# EasyEDA Pro project 【群友_M._分享】明纬rps200-24v-电源PCB垫板-内含2个版本-捷配白嫖-新.epro

# Board RPS200-24_海凌科HLK-PM01等三合一5V模块
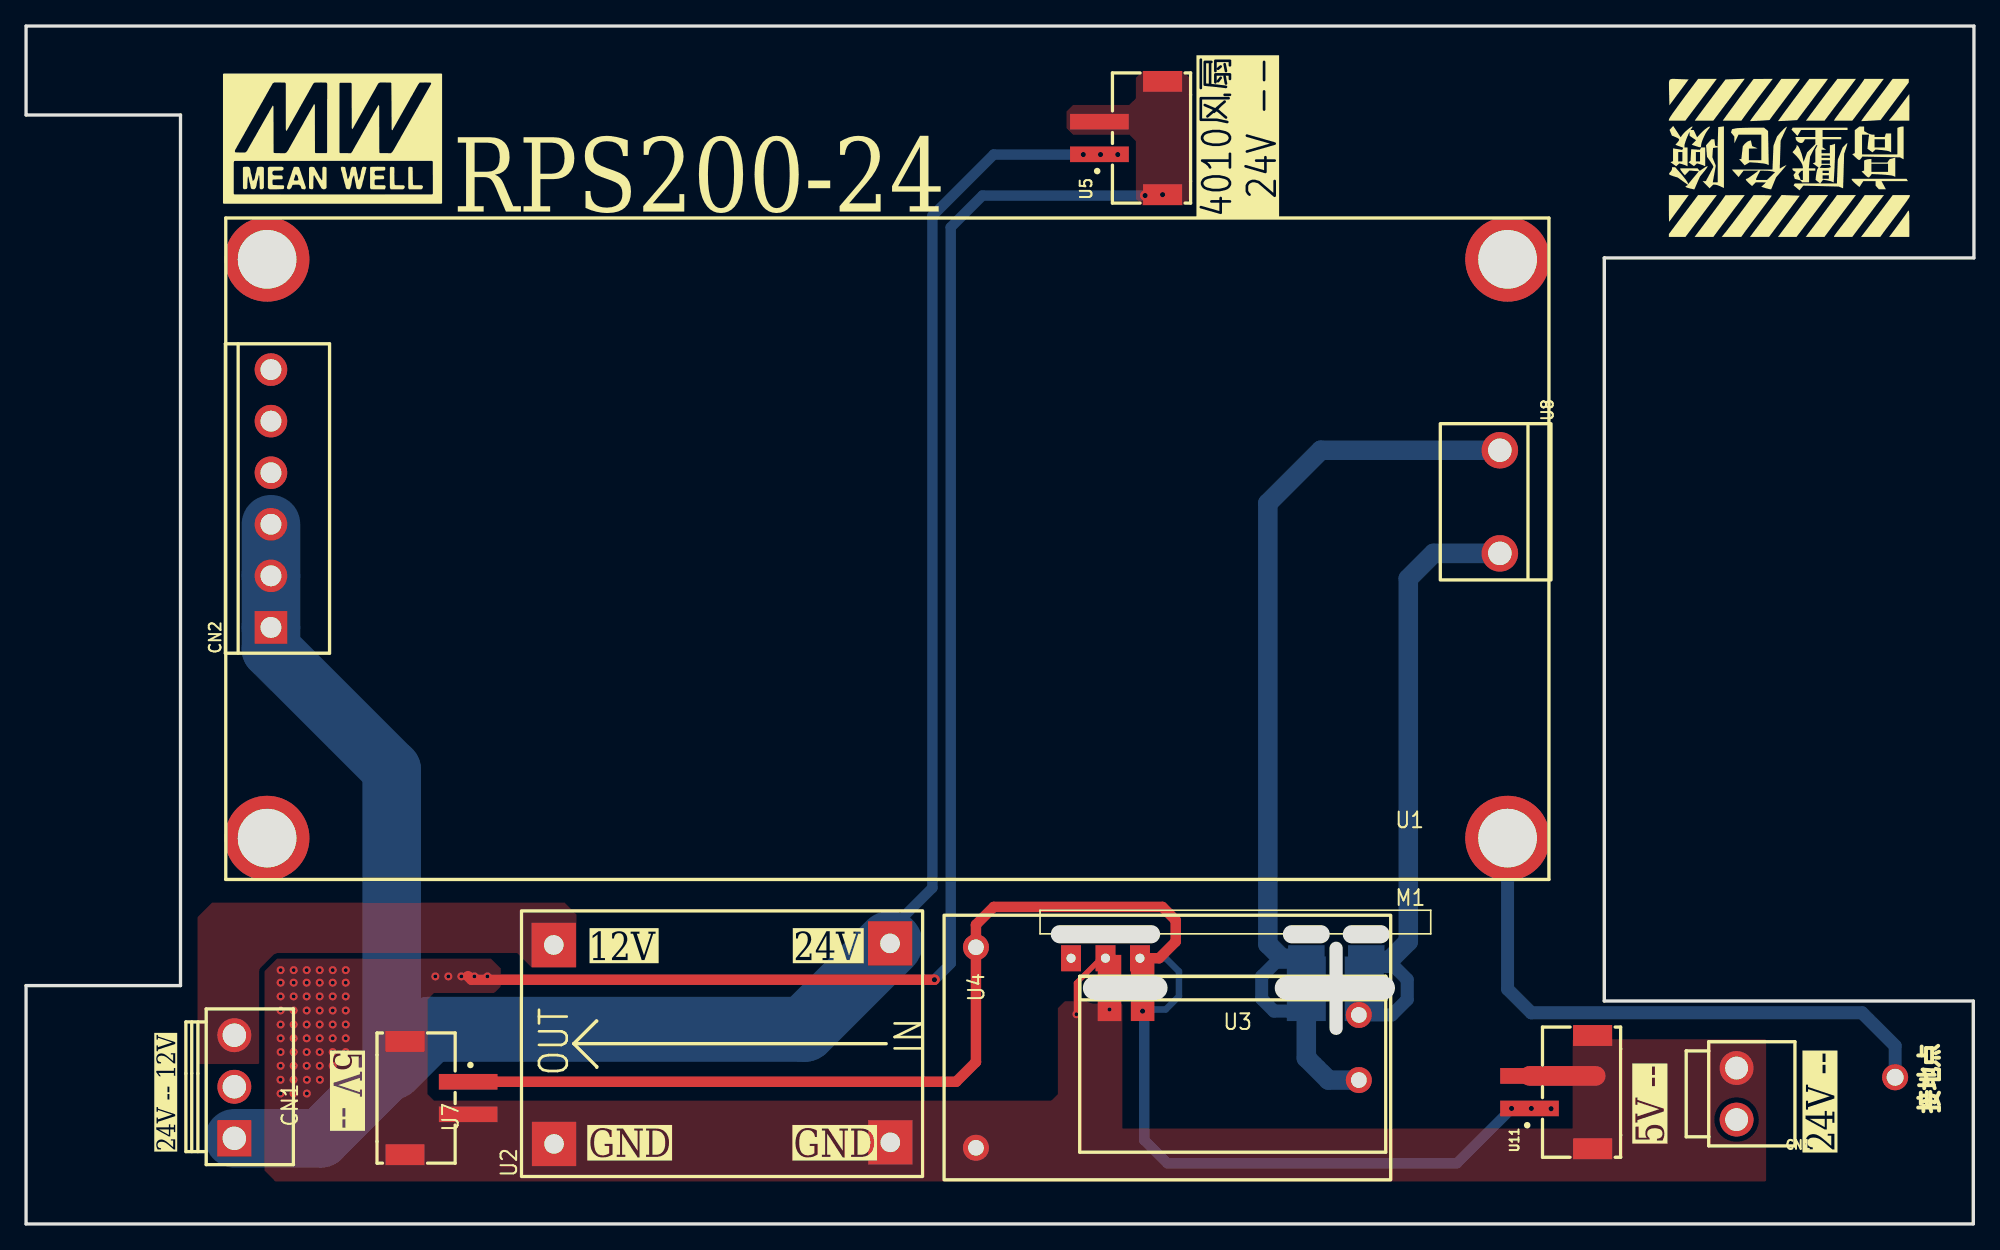
[diagram p0: board, top side]
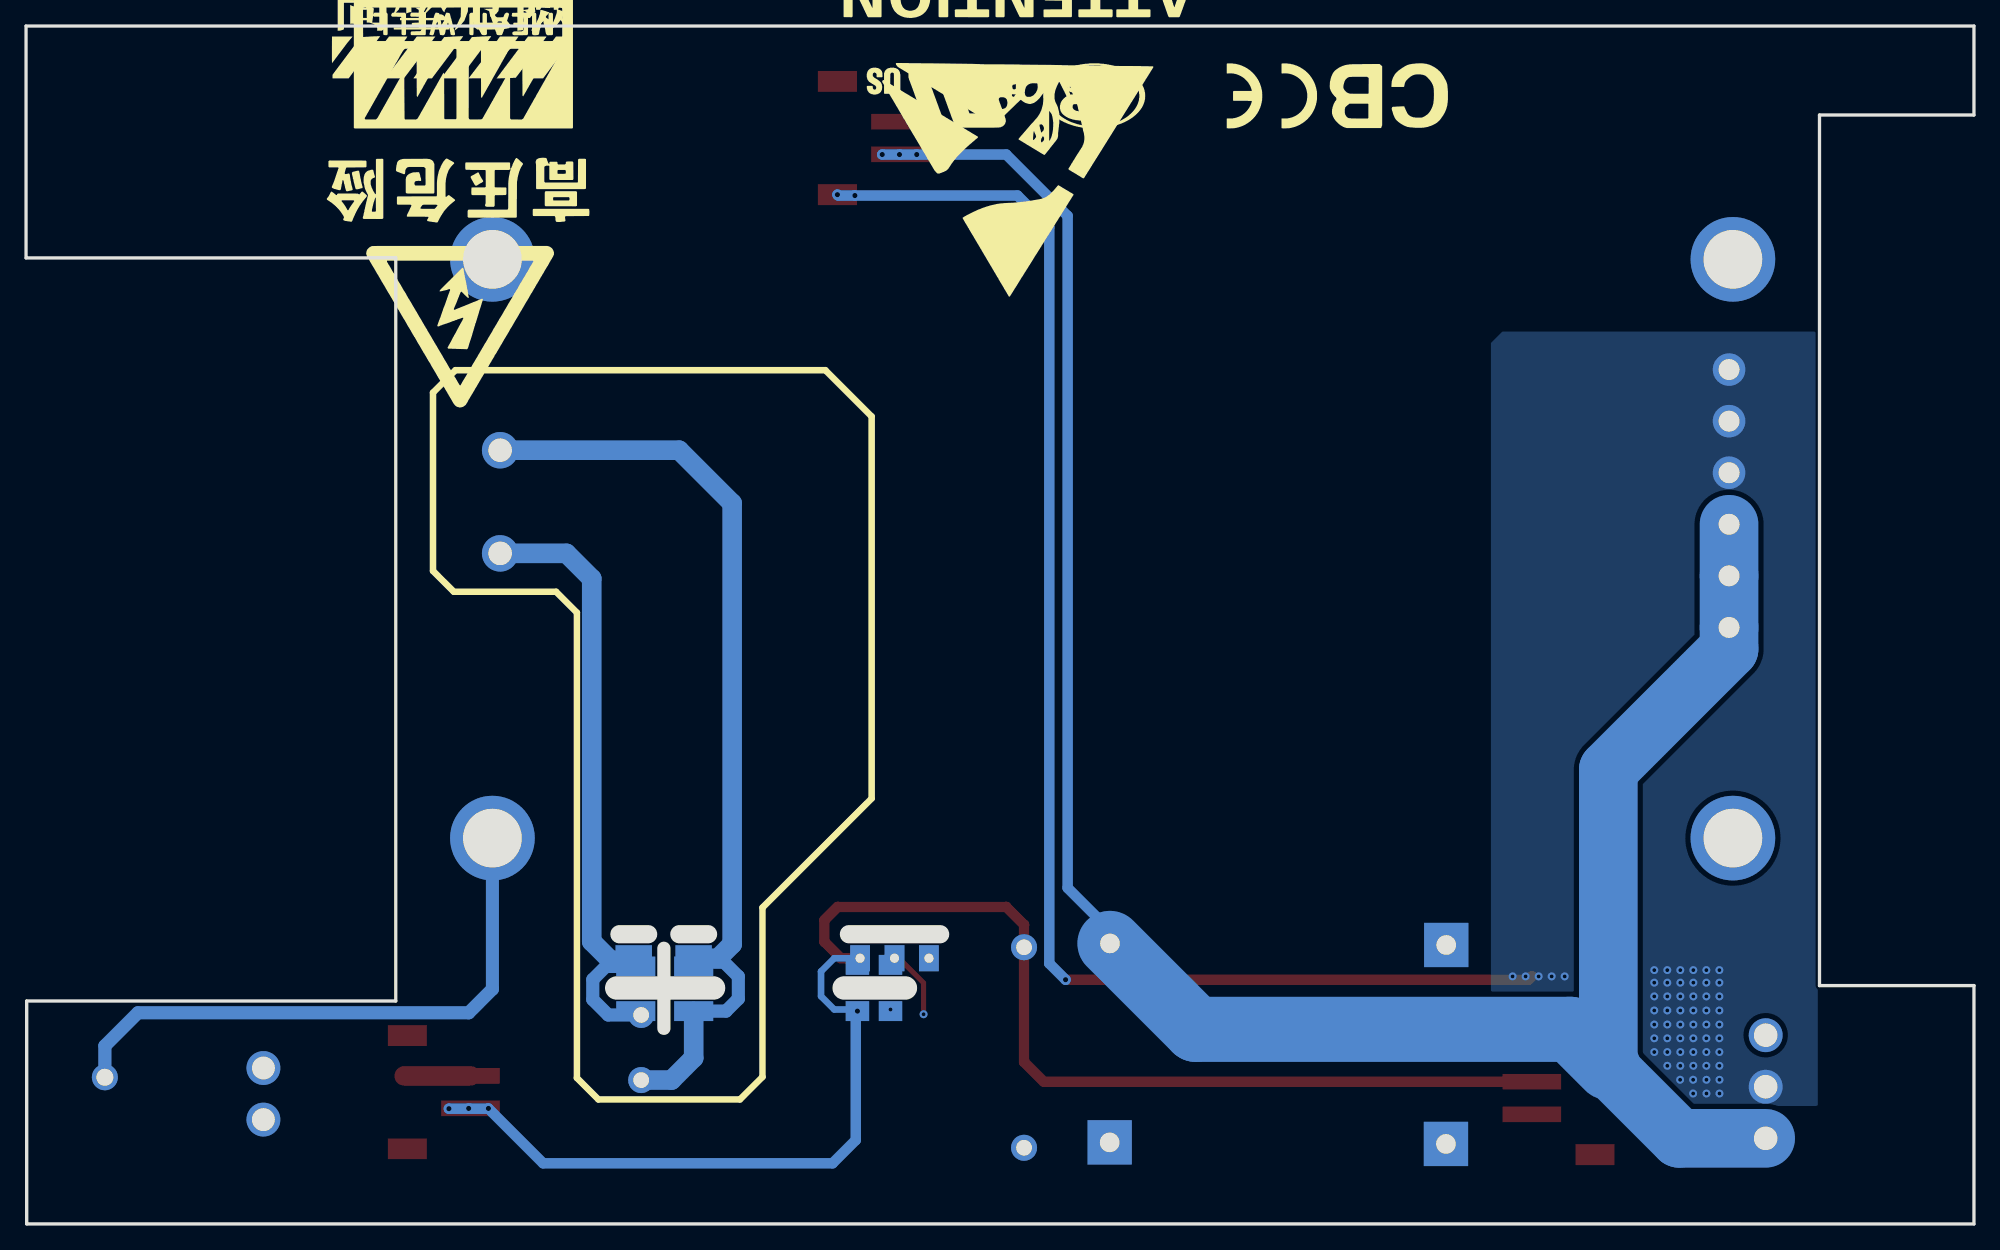
[diagram p1: board, bottom side, seen from below]

Outline 149.57 x 92 mm; copper layers: Top Layer, Inner1, Inner2, Bottom Layer. Coordinates in mm from the lower left corner of the outline.
Outline path: 0,92 0,85.17 11.86,85.17 11.86,18.31 0,18.31 0,0 149.52,0 149.52,17.12 121.18,17.12 121.18,74.19 149.57,74.19 149.57,92 0,92
Stack: Top Layer 0.035mm 外层铜厚1oz / Dielectric1 0.2104mm 7628 RC49% 8.6mil / Inner1 0.0152mm 内层铜厚 / Dielectric2 1.065mm 1.1mm H/HOZ Copper / Inner2 0.0152mm 内层铜厚 / Dielectric3 0.2104mm 7628 RC49% 8.6mil / Bottom Layer 0.035mm 外层铜厚1oz

## Design rules (mm)
template: 自定义配置
spacing copperThickness1oz (default): track to track 0.102, other pairs 0 to 0.3
spacing copperThickness2oz: track to track 0.203, other pairs 0.152 to 0.3
track width copperThickness1oz (default): min 0.127, default 0.254, max 5
track width copperThickness2oz: min 0.203, default 0.254, max 2.54
differential pair differentialPair (default): width min 0.127, default 0.254, max 2.54; gap min 0.152, default 0.152
via viaSize (default): diameter min 0.5, default 0.61, max 10; hole min 0.3, default 0.305, max 6.3

## Placement (name value [footprint] x y rotation side)
CN1  -  [CONN-TH_3P-P3.96_FWF39601-S03S22W1B]  15.99 10.54 90 top
CN1#2  -  [CONN-TH_2P-P3.96_C9900035759]  131.34 10 90 top
CN2  ZX-VH3.96-6PZZ  [CONN-TH_6P-P3.96_ZX-VH3.96-6PZZ]  18.8 55.71 90 top
M1  AC-DC-5V-3.3V-700MA  [wo-220-5v-3.3v-700ma_update]  91.58 20.41 0 top
NOREF  -  [Pad_e18]  143.52 11.26 0 top
U1  -  [RPS-200]  57.92 56.86 180 top
U2  -  [SY8205]  68.84 3.64 90 top
U3  5V700mA电源模块  [5V700MA]  104.4 19.01 270 top
U4  HLK-PM01  [PWRM-TH_HLK-PM01]  87.64 13.55 180 top
U5  ZX-XH2.54-2PLT  [CONN-SMD_2P-P2.50_HCTL_HC-XH-2ALT]  84.84 83.4 90 top
U7  ZX-XH2.54-2PLT  [CONN-SMD_2P-P2.50_HCTL_HC-XH-2ALT]  31.52 9.67 270 top
U8  VH3.96-3P(2P) ZZ  [CONN-TH_VH3.96-3A2]  113.17 55.46 270 top
U11  ZX-XH2.54-2PLT  [CONN-SMD_2P-P2.50_HCTL_HC-XH-2ALT]  117.86 10.12 90 top

## Footprints (pads in the part's own frame, mm; a bottom-side part is the same pattern mirrored in y, then rotated)
5V700MA
  rect 1.524x3 smd far side: 1(2.667,-1.651) 2(2.667,-6.096) 5(-0.762,-1.651) 6(-0.762,-6.096)
  rect 1.524x1.8 smd far side: 3(2.667,-21.209) 4(2.667,-18.669) 7(-0.889,-18.669) 8(-0.889,-21.209)
  rect 1.524x1.8 smd: 9(-0.889,-18.669) 10(-0.889,-21.209) 11(2.667,-21.209) 12(2.667,-18.669)
CONN-SMD_2P-P2.50_HCTL_HC-XH-2ALT
  rect 1.2x4.5 smd: 1(-1.25,2.425) 2(1.25,2.425)
  rect 1.6x3 smd: 3(4.35,-2.425) 4(-4.35,-2.425)
CONN-TH_2P-P3.96_C9900035759
  round 2.6 hole 1.75: 1(-1.98,0) 2(1.98,0)
CONN-TH_3P-P3.96_FWF39601-S03S22W1B
  rect 2.8x2.6 hole 1.8: 1(-3.96,0)
  round 2.6 hole 1.8: 2(0,0) 3(3.96,0)
CONN-TH_6P-P3.96_ZX-VH3.96-6PZZ
  rect 2.5x2.5 hole 1.6: 1(-9.9,0)
  round 2.5 hole 1.6: 2(-5.94,0) 3(-1.98,0) 4(1.98,0) 5(5.94,0) 6(9.9,0)
CONN-TH_VH3.96-3A2
  round 2.8 hole 1.8: 1(-3.96,0) 2(3.96,0)
Pad_e18
  round 2 hole 1.3: 1(0,0)
PWRM-TH_HLK-PM01
  round 2 hole 1.2: 1(-14.7,2.5) 2(-14.7,-2.5) 3(14.7,7.7) 4(14.7,-7.7)
RPS-200
  round 6.5 hole 4.5: 1(-55.839,27.225) 2(39.411,27.225) 3(39.411,-17.225) 4(-55.839,-17.225)
SY8205
  rect 3.4x3.4 hole 1.5: 1(2.5,28.3) 2(2.62,2.479) 3(17.9,2.5) 4(17.78,28.321)
wo-220-5v-3.3v-700ma_update
  rect 2.8x2 smd far side: 1(11.334,0) 2(6.734,0)
  rect 1.524x2 hole 0.7: 3(-6.046,0) 4(-8.69,0) 5(-11.334,0)

## Nets
5V: M1.3 U3.4 U3.7 U3.9 U3.12 U4.4 U7.1 U11.1
12V: CN1.3 U2.4
24V: CN1.1 CN1#2.1 CN2.1 CN2.2 CN2.3 U2.3 U5.1
GND: CN1.2 CN1#2.2 CN2.4 CN2.5 CN2.6 M1.4 U2.1 U2.2 U3.3 U3.8 U3.10 U3.11 U4.3 U5.2 U5.3 U5.4 U7.2 U7.3 U7.4 U11.2 U11.3 U11.4
E: NOREF.1 U1.1
L: M1.2 U3.2 U3.6 U4.1 U8.1
N: M1.1 U3.1 U3.5 U4.2 U8.2

Pads without a net: M1 5; U1 2 3 4

## Via types
v1: diameter 0.8, hole 0.4, Top Layer to Bottom Layer, 10 vias
v2: diameter 0.61, hole 0.305, Top Layer to Bottom Layer, 61 vias

## Routing (per net, layer and track width the routed paths; a pad name or vN(x,y) marks a point on that pad's centre or on a via; arc(x,y) is an arc through that point)
5V: length 123.8
  Top Layer w0.8: M1.3 87,20.41 88.27,21.68 88.27,23.33 87.26,24.35 74.3,24.35 72.94,22.98 U4.4 72.94,12.44 71.42,10.92 U7.1
  Bottom Layer w0.5: 85.53,21.04 86.16,20.41 87.51,20.41 88.53,19.39 88.53,17.49 87.51,16.47 85.86,16.47
  Bottom Layer w0.8: 85.86,16.47 85.86,6.44 87.64,4.66 109.86,4.66 114.05,8.85 v1(117.1,8.85)
  vias: v1(85.73,16.34) v1(114.07,8.87) v1(115.58,8.87)
24V: length 174.4
  Bottom Layer w0.8: 82.4,82.13 v1(81.18,82.13) 74.3,82.13 69.59,77.42 69.59,25.81 66.34,22.56 ; v1(82.5,82.13) v1(83.83,82.13)
  Bottom Layer w4.5: CN2.3 CN2.2 CN2.1 18.8,44.16 28.08,34.89 28.08,12.03 22.62,6.58 CN1.1
  Bottom Layer w5: U2.3 59.75,14.95 31,14.95 28.08,12.03
GND: length 122.1
  Top Layer w0.4: v2(80.65,16.11) 80.65,18.5 82.56,20.41 M1.4
  Top Layer w0.8: v1(69.75,18.76) 34.2,18.76 33.93,19.03
  Top Layer w1.5: U11.2 120.53,11.37
  Bottom Layer w0.8: v1(69.75,18.76) 71,20.01 71,76.54 73.44,78.98 v1(85.93,78.98) 87.2,78.98 v1(87.27,79.05)
  vias: v2(19.55,19.49) v2(19.55,18.53) v2(19.55,17.48) v2(19.55,16.4) v2(19.55,15.32) v2(19.55,14.26) v2(19.55,13.2) v2(19.55,12.15) v2(19.54,11.07) v2(19.54,10.02) v2(20.55,19.49) v2(20.55,18.53) v2(20.55,17.48) v2(20.55,16.4) v2(20.55,15.32) v2(20.55,14.26) v2(20.55,13.2) v2(20.55,12.15) v2(20.54,11.07) v2(20.54,10.02) v2(21.55,19.49) v2(21.55,18.53) v2(21.55,17.48) v2(21.55,16.4) v2(21.55,15.32) v2(21.55,14.26) v2(21.55,13.2) v2(21.55,12.15) v2(21.56,11.07) v2(21.56,10.02) v2(22.55,19.49) v2(22.55,18.53) v2(22.55,17.48) v2(22.55,16.4) v2(22.55,15.32) v2(22.55,14.26) v2(22.55,13.2) v2(22.55,12.15) v2(22.56,11.07) v2(23.55,19.49) v2(23.55,18.53) v2(23.55,17.48) v2(23.55,16.4) v2(23.55,15.32) v2(23.55,14.26) v2(23.55,13.2) v2(23.55,12.15) v2(24.55,19.49) v2(24.55,18.53) v2(24.55,17.48) v2(24.55,16.4) v2(24.55,15.32) v2(24.55,14.26) v2(24.55,13.2) v2(31.43,19.01) v2(32.43,19.01) v2(33.43,19.01) v2(34.43,19.01) v2(35.43,19.01) v2(83.19,16.47)
E: length 45.6
  Bottom Layer w1: NOREF.1 143.52,13.68 140.98,16.22 115.58,16.22 113.76,18.04 U1.1
L: length 74.6
  Bottom Layer w1: 98,20.09 U3.6 ; 97.98,20.1 95.97,20.1 94.88,19.01 94.88,17.29 95.82,16.34 U3.2
  Bottom Layer w1.5: U4.1 100.01,11.05 98.31,12.75 98.31,16.32 ; U8.1 99.42,59.42 95.35,55.35 95.35,21.48 96.44,20.4 98.31,20.4
N: length 49.6
  Bottom Layer w1: U3.5 105.05,19.77 106.05,18.77 106.05,17.23 104.87,16.05 U4.2 ; 102.34,16.56 102.85,16.56
  Bottom Layer w1.5: M1.1 103.08,20.24 104.68,20.24 106.13,21.69 106.13,49.56 108.07,51.5 U8.2

## Copper pours and planes (outline as drawn; the poured copper is in the pictures)
12V on Top Layer: 42.27,19.66 38.85,19.66 37.7,20.82 19.26,20.82 17.99,19.55 17.99,12.28 13.17,12.28 13.17,23.56 14.28,24.68 41.36,24.68 42.27,23.76
24V on Inner1: 80.45,2.59 79.75,2.89 71.69,10.95 70.98,11.24 69.26,11.24 68.55,11.53 64.51,15.57 64.22,16.28 64.22,23.76 64.68,24.22 68.3,24.22 68.79,23.73 68.79,18.64 69.08,17.93 71.6,15.42 72.3,15.13 77.42,15.13 78.13,14.83 84.35,8.61 85.06,8.32 92.41,8.32 93.11,8.03 93.9,7.24 94.61,6.95 125.87,6.95 129.17,10.25 135.01,10.25 135.64,9.61 135.64,3.07 135.17,2.59
24V on Inner2: 80.45,2.59 79.75,2.89 71.69,10.95 70.98,11.24 69.26,11.24 68.55,11.53 64.51,15.57 64.22,16.28 64.22,23.76 64.68,24.22 68.3,24.22 68.79,23.73 68.79,18.64 69.08,17.93 71.6,15.42 72.3,15.13 77.42,15.13 78.13,14.83 84.35,8.61 85.06,8.32 92.41,8.32 93.11,8.03 93.9,7.24 94.61,6.95 125.87,6.95 129.17,10.25 135.01,10.25 135.64,9.61 135.64,3.07 135.17,2.59
GND on Top Layer: 79.89,88.53 89.34,88.53 89.34,78.23 79.89,78.23
GND on Top Layer: 35.7,20.37 36.46,19.62 36.46,18.24 35.96,17.74 31.33,17.74 30.83,17.24 30.83,9.97 31.33,9.47 78.72,9.47 79.22,9.97 79.22,16.57 79.76,17.11 84.04,17.11 84.18,16.97 84.18,7.33 118.75,7.33 118.75,14.19 133.61,14.19 133.61,3.26 19.14,3.26 18.3,4.1 18.3,19.4 19.28,20.37
GND on Bottom Layer: 12,9.06 37.09,9.06 37.09,67.66 36.22,68.53 12,68.53
GND on Inner1: 36.46,19.62 36.46,18.24 35.96,17.74 31.33,17.74 30.83,17.24 30.83,9.97 31.33,9.47 72.36,9.47 74.18,7.66 74.18,3.26 19.14,3.26 18.3,4.1 18.3,19.35 19.31,20.36 35.72,20.36
GND on Inner2: 36.46,19.62 36.46,18.24 35.96,17.74 31.33,17.74 30.83,17.24 30.83,9.97 31.33,9.47 72.36,9.47 74.18,7.66 74.18,3.26 19.14,3.26 18.3,4.1 18.3,19.35 19.31,20.36 35.72,20.36

## Text on the board
Document Layer: 220V转5V模块 | 220V转5V、3V双输出模块 | 海凌科HLK-PM01 5V 3W
Top Silkscreen Layer: OUT | IN | RPS200-24 | 接地点 | 24V -- 12V | 12V | GND | 24V | 4010风扇 / 24V -- | 5V -- | 24V --

# Board RPS200-24_URB2405ZP-6WR
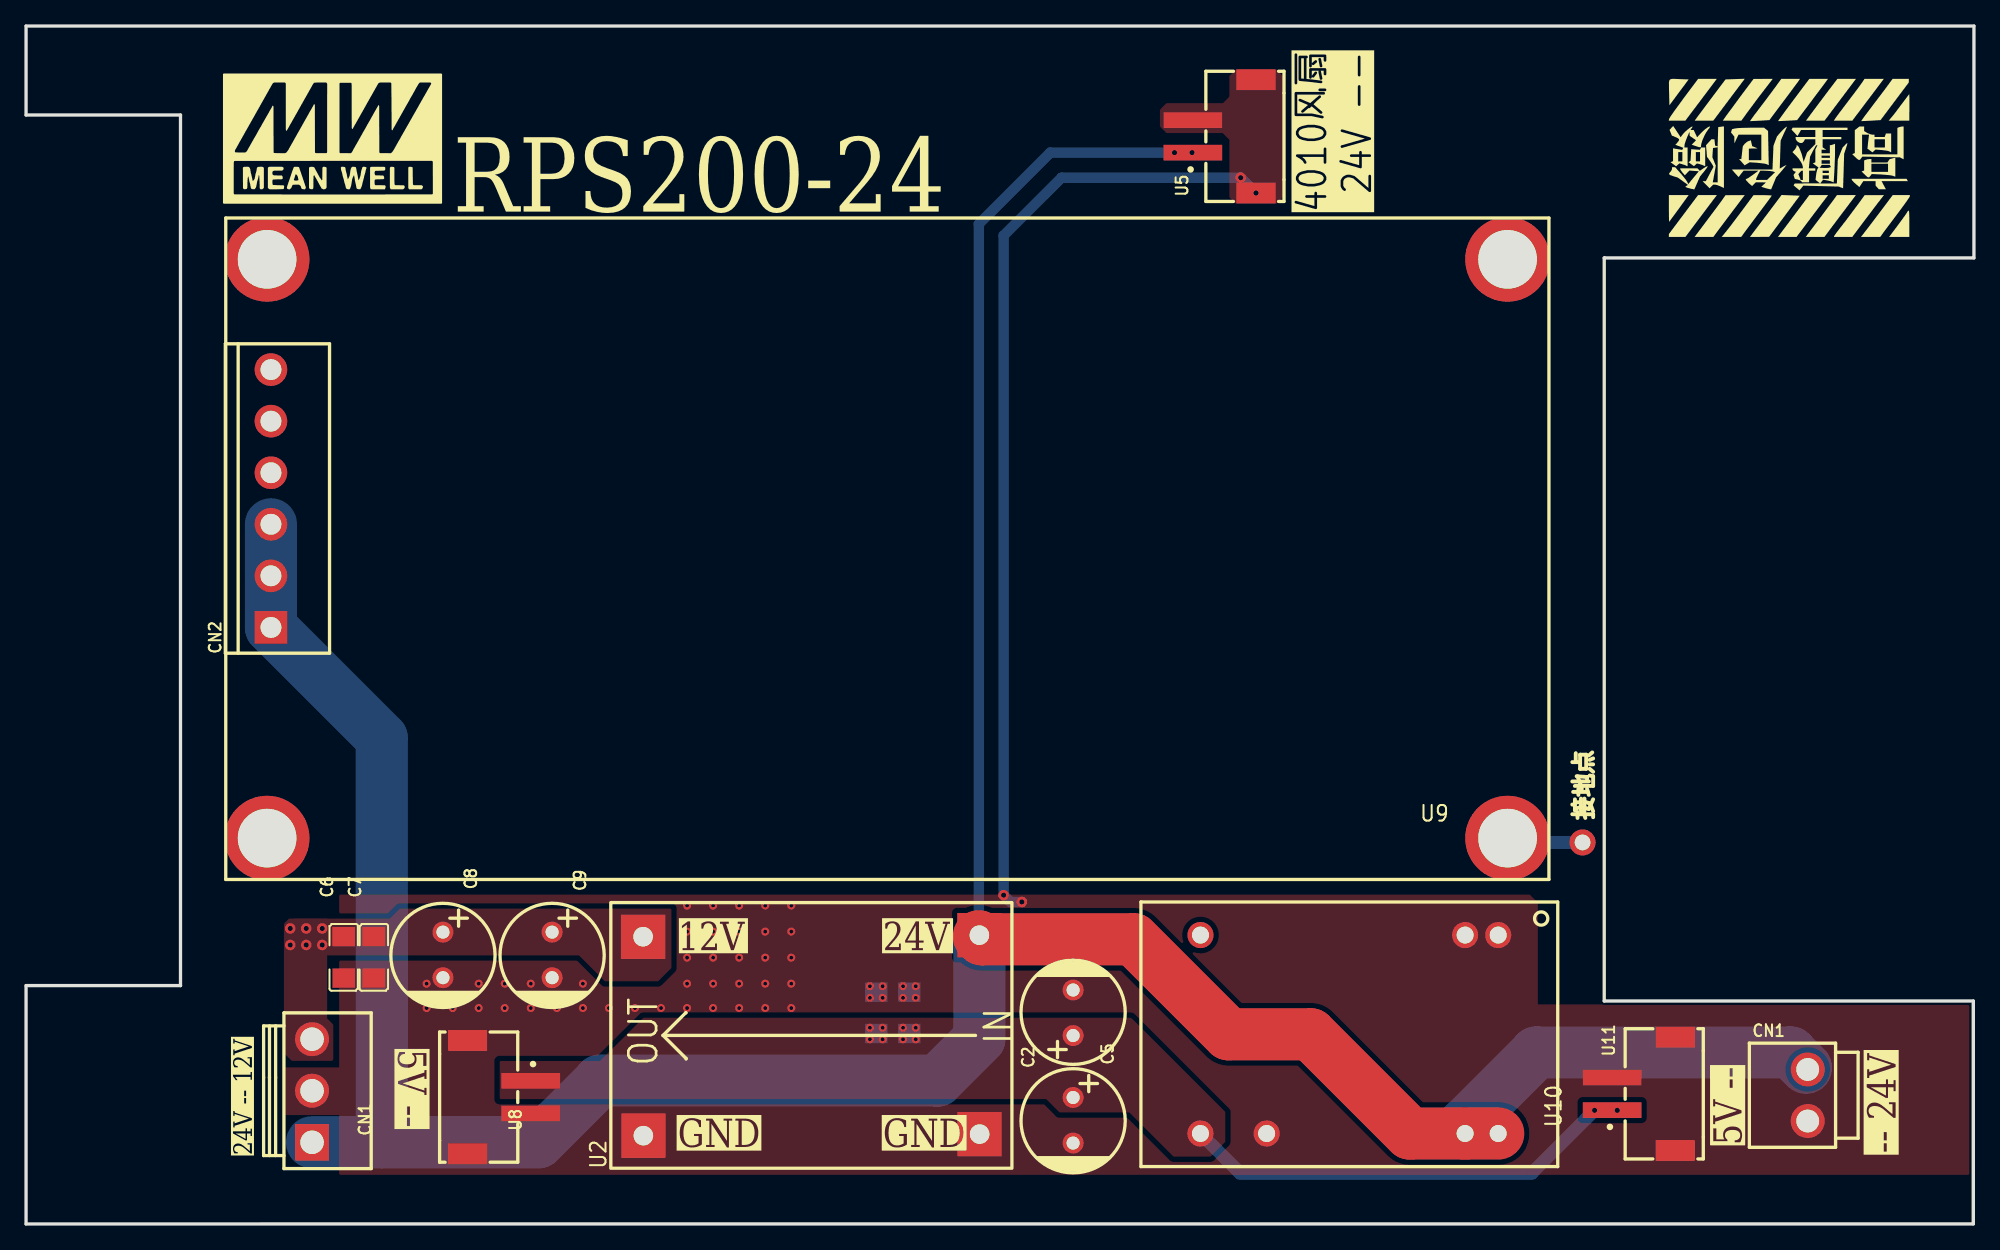
[diagram p2: board, top side]
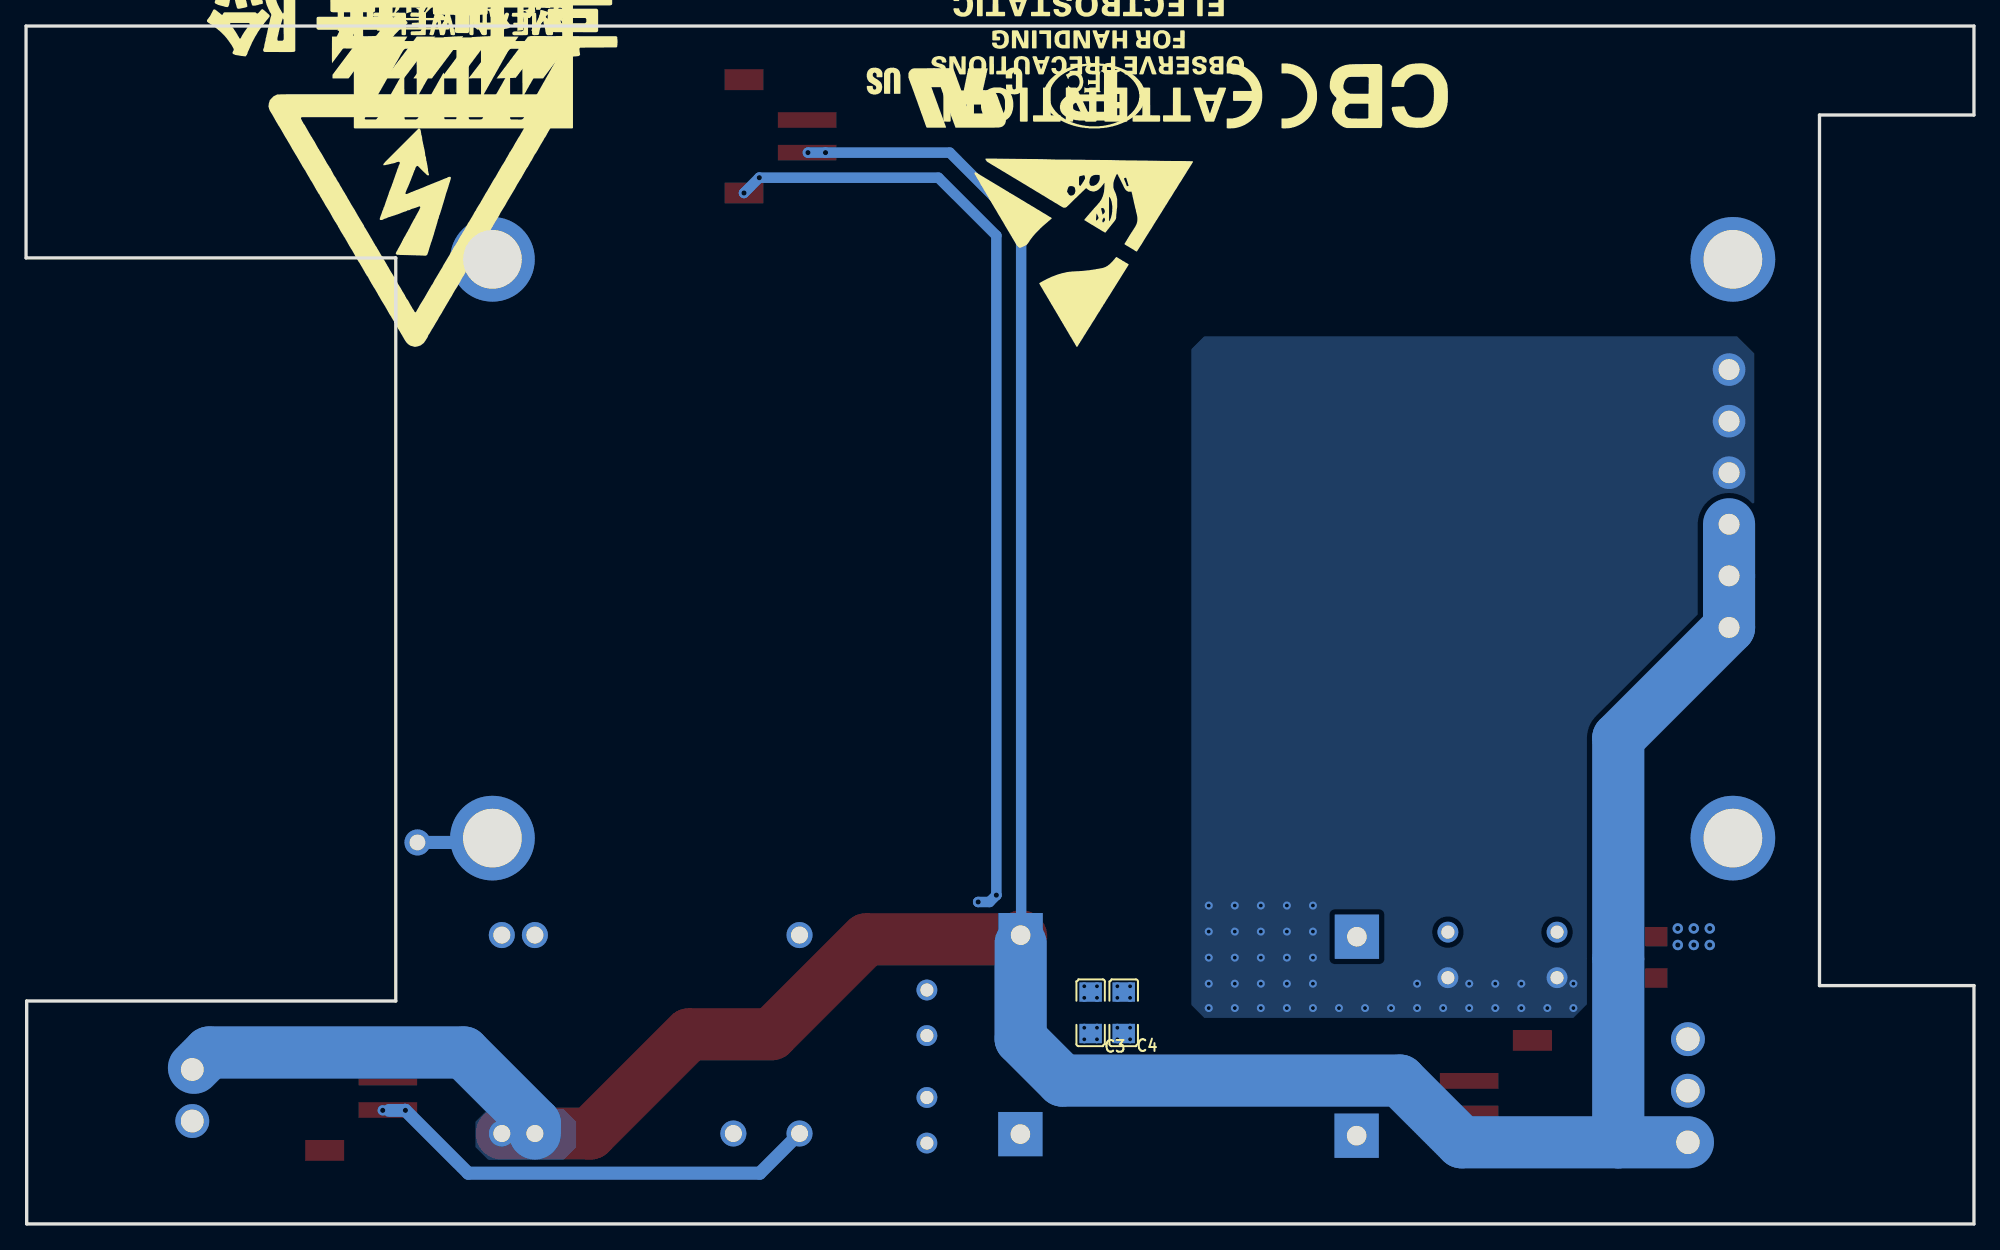
[diagram p3: board, bottom side, seen from below]

Outline 149.57 x 92 mm; copper layers: Top Layer, Inner1, Inner2, Bottom Layer. Coordinates in mm from the lower left corner of the outline.
Outline path: 0,92 0,85.17 11.86,85.17 11.86,18.31 0,18.31 0,0 149.52,0 149.52,17.12 121.18,17.12 121.18,74.19 149.57,74.19 149.57,92 0,92
Stack: Top Layer 0.035mm 外层铜厚1oz / Dielectric1 0.2104mm 7628 RC49% 8.6mil / Inner1 0.0152mm 内层铜厚 / Dielectric2 1.065mm 1.1mm H/HOZ Copper / Inner2 0.0152mm 内层铜厚 / Dielectric3 0.2104mm 7628 RC49% 8.6mil / Bottom Layer 0.035mm 外层铜厚1oz

## Design rules (mm)
template: 自定义配置
spacing copperThickness1oz (default): track to track 0.102, other pairs 0.152 to 0.3
spacing copperThickness2oz: track to track 0.203, other pairs 0.152 to 0.3
track width copperThickness1oz (default): min 0.127, default 0.254, max 4
track width copperThickness2oz: min 0.203, default 0.254, max 4
differential pair differentialPair (default): width min 0.127, default 0.254, max 2.54; gap min 0.152, default 0.152
via viaSize (default): diameter min 0.5, default 0.61, max 10; hole min 0.3, default 0.305, max 6.3

## Placement (name value [footprint] x y rotation side)
C2  470uF  [CAP-TH_BD8.0-P3.50-D0.6-FD]  80.4 16.22 90 top
C3  100nF  [C1206]  67.83 16.22 90 bottom
C4  100nF  [C1206]  65.29 16.22 90 bottom
C5  470uF  [CAP-TH_BD8.0-P3.50-D0.6-FD]  80.4 7.96 270 top
C6  100nF  [C1206]  24.39 20.47 270 top
C7  100nF  [C1206]  26.71 20.47 270 top
C8  470uF  [CAP-TH_BD8.0-P3.50-D0.6-FD]  32.01 20.66 270 top
C9  470uF  [CAP-TH_BD8.0-P3.50-D0.6-FD]  40.39 20.66 270 top
CN1  -  [CONN-TH_3P-P3.96_FWF39601-S03S22W1B]  21.96 10.23 90 top
CN1#2  -  [CONN-TH_2P-P3.96_C9900035759]  136.81 9.89 270 top
CN2  ZX-VH3.96-6PZZ  [CONN-TH_6P-P3.96_ZX-VH3.96-6PZZ]  18.8 55.72 90 top
NOREF  -  [Pad_e47]  119.52 29.3 0 top
U2  -  [SY8205]  75.7 4.28 90 top
U5  ZX-XH2.54-2PLT  [CONN-SMD_2P-P2.50_HCTL_HC-XH-2ALT]  92.02 83.53 90 top
U8  ZX-XH2.54-2PLT  [CONN-SMD_2P-P2.50_HCTL_HC-XH-2ALT]  36.33 9.74 270 top
U9  -  [RPS-200]  57.92 56.86 180 top
U10  URB2405ZP-6WR3  [PWRM-TH_URBXXXXZP-6WR3]  101.61 14.57 180 top
U11  ZX-XH2.54-2PLT  [CONN-SMD_2P-P2.50_HCTL_HC-XH-2ALT]  124.21 10 90 top

## Footprints (pads in the part's own frame, mm; a bottom-side part is the same pattern mirrored in y, then rotated)
C1206
  rect 1.485x1.728 smd: 1(-1.593,0) 2(1.593,0)
CAP-TH_BD8.0-P3.50-D0.6-FD
  round 1.6 hole 1: 1(-1.75,0) 2(1.75,0)
CONN-SMD_2P-P2.50_HCTL_HC-XH-2ALT
  rect 1.2x4.5 smd: 1(-1.25,2.425) 2(1.25,2.425)
  rect 1.6x3 smd: 3(4.35,-2.425) 4(-4.35,-2.425)
CONN-TH_2P-P3.96_C9900035759
  round 2.6 hole 1.75: 1(-1.98,0) 2(1.98,0)
CONN-TH_3P-P3.96_FWF39601-S03S22W1B
  rect 2.8x2.6 hole 1.8: 1(-3.96,0)
  round 2.6 hole 1.8: 2(0,0) 3(3.96,0)
CONN-TH_6P-P3.96_ZX-VH3.96-6PZZ
  rect 2.5x2.5 hole 1.6: 1(-9.9,0)
  round 2.5 hole 1.6: 2(-5.94,0) 3(-1.98,0) 4(1.98,0) 5(5.94,0) 6(9.9,0)
Pad_e47
  round 2 hole 1.2: 1(0,0)
PWRM-TH_URBXXXXZP-6WR3
  round 2 hole 1.3: 2(-11.43,-7.62) 3(-8.89,-7.62) 11(11.43,-7.62) 14(11.43,7.62) 16(6.35,7.62) 22(-8.89,7.62) 23(-11.43,7.62)
RPS-200
  round 6.5 hole 4.5: 1(-55.839,27.225) 2(39.411,27.225) 3(39.411,-17.225) 4(-55.839,-17.225)
SY8205
  rect 3.4x3.4 hole 1.5: 1(2.5,28.3) 2(2.62,2.479) 3(17.9,2.5) 4(17.78,28.321)

## Nets
5V: C2.1 C3.1 C4.1 C5.1 U8.1 U10.14 U11.1
12V: C6.1 C7.1 C8.1 C9.1 CN1.3 U2.4
24V: CN1.1 CN1#2.1 CN2.1 CN2.2 CN2.3 U2.3 U5.1 U10.22 U10.23
GND: C2.2 C3.2 C4.2 C5.2 C6.2 C7.2 C8.2 C9.2 CN1.2 CN1#2.2 CN2.4 CN2.5 CN2.6 U2.1 U2.2 U5.2 U5.3 U5.4 U8.2 U8.3 U8.4 U10.2 U10.3 U10.16 U11.2 U11.3 U11.4
E: NOREF.1 U9.1

Pads without a net: U9 2 3 4; U10 11

## Via types
v1: diameter 0.61, hole 0.305, Top Layer to Bottom Layer, 56 vias
v2: diameter 0.8, hole 0.4, Top Layer to Bottom Layer, 14 vias

## Routing (per net, layer and track width the routed paths; a pad name or vN(x,y) marks a point on that pad's centre or on a via; arc(x,y) is an arc through that point)
5V: length 34.8
  Bottom Layer w1: U10.14 93.23,3.9 115.62,3.9 v2(120.44,8.72) 121.67,8.72
  vias: v1(64.8,15.07) v1(64.8,14.18) v1(65.77,15.07) v1(65.77,14.18) v1(67.34,15.07) v1(67.34,14.18) v1(68.31,15.07) v1(68.31,14.18) v2(122.18,8.72)
12V:
  vias: v2(20.29,22.69) v2(20.29,21.43) v2(21.51,22.69) v2(21.51,21.43) v2(22.74,22.69) v2(22.74,21.43)
24V: length 261.8
  Top Layer w4: 73.16,22.09 73.39,21.86 85.04,21.86 92.34,14.57 98.64,14.57 106.26,6.95 U10.22 U10.23
  Bottom Layer w0.8: 73.16,22.09 73.16,76.8 78.64,82.28 v2(88.18,82.28) v2(89.53,82.28)
  Bottom Layer w4: CN2.3 CN2.2 CN2.1 27.31,37.31 27.31,20.49 ; 27.31,20.28 27.31,6.27 ; 27.31,6.27 CN1.1 ; 27.31,6.27 39.34,6.27 44.08,11.01 69.99,11.01 73.2,14.23 73.2,21.54 ; 136.68,11.99 135.5,13.17 115.96,13.17 110.5,7.71 U10.22
GND: length 74
  Bottom Layer w0.8: v2(76.46,24.73) 75.59,24.73 v2(75.07,25.25) 75.07,75.91 79.51,80.35 v2(93.27,80.35) v2(94.44,79.18)
  vias: v1(30.76,18.45) v1(30.76,16.58) v1(32.76,16.58) v1(34.76,18.45) v1(34.76,16.58) v1(36.76,18.45) v1(36.76,16.58) v1(38.76,18.45) v1(38.76,16.58) v1(40.76,16.58) v1(42.76,18.45) v1(42.76,16.58) v1(44.76,16.58) v1(46.76,16.58) v1(48.76,16.58) v1(50.76,24.45) v1(50.76,22.45) v1(50.76,20.45) v1(50.76,18.45) v1(50.76,16.58) v1(52.76,24.45) v1(52.76,22.45) v1(52.76,20.45) v1(52.76,18.45) v1(52.76,16.58) v1(54.76,24.45) v1(54.76,22.45) v1(54.76,20.45) v1(54.76,18.45) v1(54.76,16.58) v1(56.76,24.45) v1(56.76,22.45) v1(56.76,20.45) v1(56.76,18.45) v1(56.76,16.58) v1(58.76,24.45) v1(58.76,22.45) v1(58.76,20.45) v1(58.76,18.45) v1(58.76,16.58) v1(64.8,18.25) v1(64.8,17.37) v1(65.77,18.25) v1(65.77,17.37) v1(67.34,18.25) v1(67.34,17.37) v1(68.31,18.25) v1(68.31,17.37)
E: length 5.9
  Bottom Layer w1: NOREF.1 114.09,29.3 U9.1

## Copper pours and planes (outline as drawn; the poured copper is in the pictures)
5V on Top Layer: 78.33,9.59 36.37,9.59 36.37,12.51 44.07,12.51 47.4,15.84 84.84,15.84 92.08,8.6 92.08,6.31 90.94,5.17 88.11,5.17 84.72,8.56 79.36,8.56
12V on Top Layer: 49.56,24.22 49.56,19.66 48.52,18.63 44.46,18.63 42.46,20.62 20.57,20.62 20.57,23.45 27.94,23.45 28.71,24.22
12V on Top Layer: 23.58,12.53 20.39,12.53 19.8,13.12 19.8,23.06 20.2,23.46 23.12,23.46 23.12,15.78 23.58,15.32
12V on Inner1: 49.56,24.22 49.56,19.66 48.52,18.63 44.46,18.63 42.46,20.62 19.81,20.62 19.81,23.45 27.94,23.45 28.71,24.22
12V on Inner2: 49.56,24.22 49.56,19.66 48.52,18.63 44.46,18.63 42.46,20.62 19.81,20.62 19.81,23.45 27.94,23.45 28.71,24.22
24V on Bottom Layer: 108.32,4.91 114.07,4.91 115.07,5.91 115.07,7.85 114.07,8.85 108.32,8.85 107.32,7.85 107.32,5.91
GND on Top Layer: 92.39,78.86 92.39,83.28 91.89,83.78 87.56,83.78 87.06,84.28 87.06,85.57 87.56,86.07 91.89,86.07 92.39,86.57 92.39,88.16 92.89,88.66 96.01,88.66 96.51,88.16 96.51,78.86 96.01,78.36 92.89,78.36
GND on Top Layer: 24.04,3.77 24.04,8.36 19.8,8.36 19.8,12.03 24.04,12.03 24.04,25.3 115.46,25.3 116.09,24.67 116.09,4.65 115.21,3.77
GND on Top Layer: 115.18,3.77 151.92,3.77 151.92,16.85 115.18,16.85
GND on Bottom Layer: 16.87,43.05 29.6,30.31 29.6,16.98 30.76,15.82 59.1,15.82 60.1,16.82 60.1,67.18 59.1,68.18 18.19,68.18 16.87,66.86

## Text on the board
Document Layer: URB2405ZP-6WR3
Top Silkscreen Layer: OUT | IN | RPS200-24 | 接地点 | 24V -- 12V | 12V | GND | 24V | 4010风扇 / 24V -- | 5V -- | -- 24V
